# EAGLE design lm317-laser-driver-mk-1.0 (EAGLE 7.5.0)
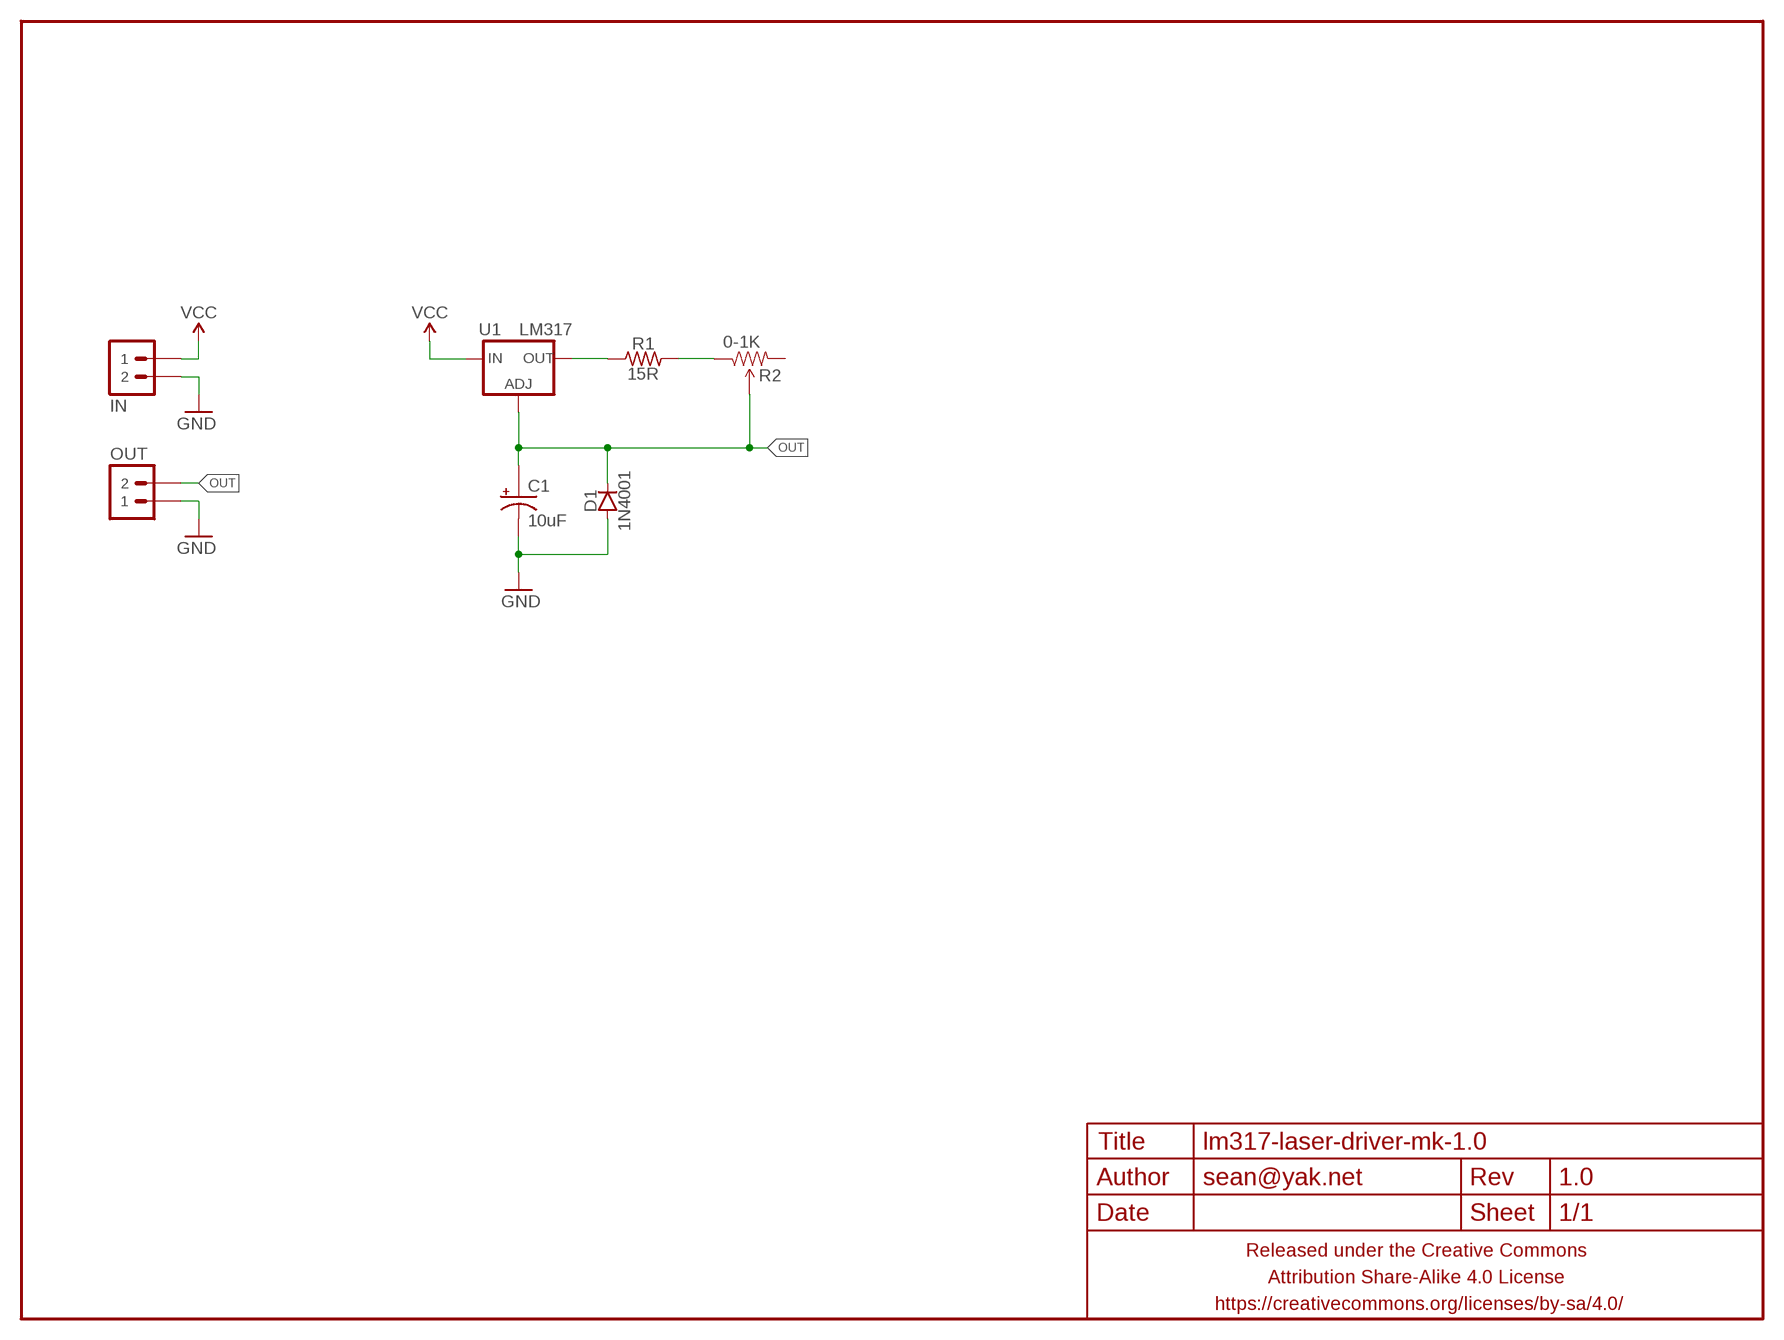
[diagram p0: schematic, sheet 1]

## Parts
C1  10uF  CAPACITOR-POLARIZEDE2.5-6  [E2,5-6]
D1  1N4001  DIODEPTH-10.68MM-NOSYM  [DIODE-10.16MM-NOSYMBOL]
FRAME1  FRAME-LETTERNO_PACKAGE  [DUMMY]
IN  M02PTH-CENTERED-R+  [1X02-CENTER-R+]
OUT  M02PTH-CENTERED-R+  [1X02-CENTER-R+]
R1  15R  RESISTORPTH-AXIAL-10.16MM  [RESISTOR-AXIAL-PTH-10.16MM]
R2  0-1K  TRIMPOTPTH2  [TRIM_POT_PTH2]
U1  LM317  V_REG_317THERMPAD  [TO220-THERMPAD]

## Nets
GND: C1.- D1.A IN.2 OUT.1
N$1: R1.P$2 R2.1(CCW)
N$2: R1.P$1 U1.2@1(OUT) U1.2@2(OUT)
OUT: C1.+ D1.C OUT.2 R2.2(WIPER) U1.1(ADJ)
VCC: IN.1 U1.3(IN)
Unconnected: R2.3(CW)

## Library data of the parts
C1 = a_parts:CAPACITOR-POLARIZED: POLARIZED CAPACITOR, American symbol
D1 = a_parts:DIODE: Diode These are standard reverse protection diodes and small signal diodes. SMA package can handle up to about 1A. SOD-323 can handle about 200mA. What the SOD-323 package when ordering, there are some mfgs out there that are 5-pin packages.
FRAME1 = a_parts:FRAME-LETTER: Schematic Frame Standard 8.5x11 US Letter frame; DESIGNER: sean@yak.net; VERSION: 1.0
IN OUT = a_parts:M02: Standard 2-pin 0.1" header. Use with - straight break away headers ( PRT-00116) - right angle break away headers (PRT-00553) - swiss pins (PRT-00743) - machine pins (PRT-00117) - female headers (PRT-00115) Molex polarized connector foot print use with: PRT-08233 with associated crimp pins and housings. 2.54_SCREWTERM for use with PRT-10571. 3.5mm Screw Terminal footprints for PRT-08084 5mm Screw Terminal footprints for use with PRT-08433
R1 = a_parts:RESISTOR: RESISTOR, American symbol
R2 = a_parts:TRIMPOT: Various small potentiometers for "set-and-forget" applications
U1 = a_parts:V_REG_317: Voltage Regulator Standard LM317 adjustable voltage regulator. AOI (Adjust Output Input). Google 'LM317 Calculator' for easy to use app to get the two resistor values needed. 240/720 for 5V output. 240/390 for 3.3V output. Spark Fun Electronics SKU : COM-00527

## Board
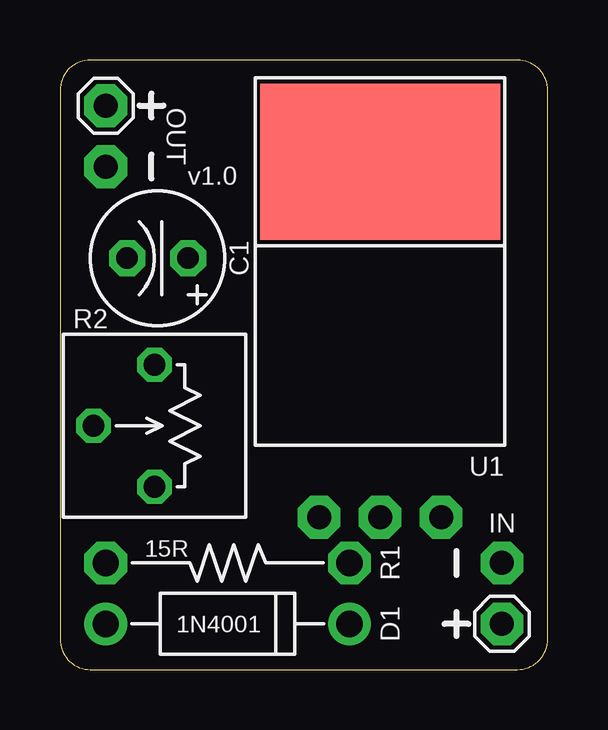
[diagram p1: board, top side]
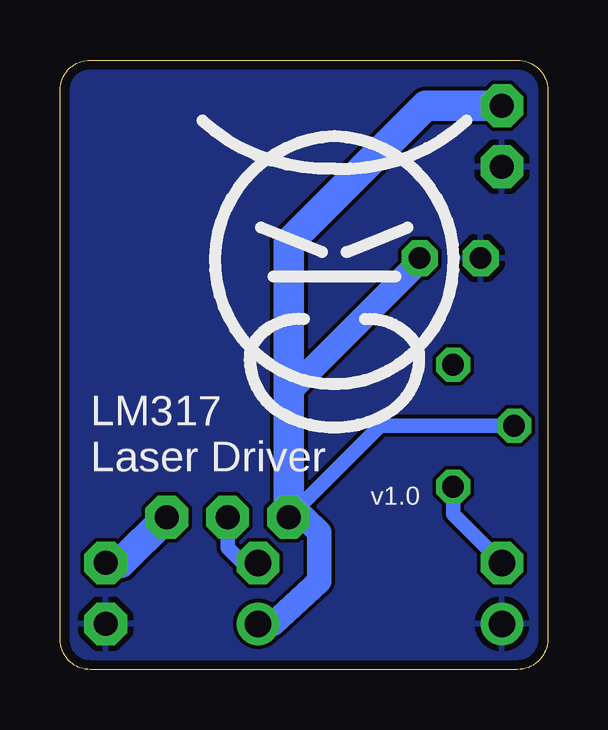
[diagram p2: board, bottom side, seen from below]

Size 20.32 x 25.4 mm. Coordinates in mm from the lower left corner, seen from the top.
Outline: 0,24.13 0,1.27 arc90 1.27,0 19.05,0 arc90 20.32,1.27 20.32,24.13 arc90 19.05,25.4 1.27,25.4 arc90 0,24.13
Copper layers (1*16): Top 0.0356mm / dielectric 1.5011mm / Bottom 0.0356mm
Design rules "LaenPCBOrder_2": minimum track width 6mil, minimum drill 13mil, track to track 6mil, track to pad 6mil, pad to pad 6mil, via to via 6mil, smd to smd 6mil, copper to edge 15mil, drill to drill 6mil, minimum pad ring 7mil, minimum via ring 7mil, stop-mask expansion 3mil, vias tented up to drill 20mil, thermal gap 10mil

### Footprints (pad centres in the part's own frame; a part is rotated, then mirrored left to right if it is on the bottom)
E2,5-6 = drill 0.9 pad 1.5 octagon: + -1.27,0; - 1.27,0
DIODE-10.16MM-NOSYMBOL = drill 1.1 pad 1.778: A -5.08,0; C 5.08,0
1X02-CENTER-R+ = drill 1 pad 1.778 octagon: 1 -1.27,0; 2 1.27,0
RESISTOR-AXIAL-PTH-10.16MM = drill 1.1 pad 1.778 octagon: P$1 -5.08,0; P$2 5.08,0
TRIM_POT_PTH2 = drill 0.9 pad 1.422 octagon: 1 -2.54,0; 2 0,2.54; 3 2.54,0
TO220-THERMPAD = drill 1 pad 1.778 octagon: 1 -2.54,0; 2@2 0,0; 3 2.54,0 | smd 10 x 6.5: 2@1 0,14.81

### Placement (x,y rotation side)
C1  4.06,17.14 180 top
D1  6.99,1.91 0 top
FRAME1  0,0 0 top
IN  18.41,3.17 270 top
OUT  1.91,22.23 90 top
R1  6.99,4.45 180 top
R2  3.94,10.16 90 top
U1  13.34,6.35 0 top
U$1  [COW]  8.89,15.88 0 bottom

### Tracks (layer width: path | path; a pad name or v marks a point on that pad's centre or on a via)
GND
  pour Bottom: 0,24.13 0,1.27 arc90 1.27,0 19.05,0 arc90 20.32,1.27 20.32,24.13 arc90 19.05,25.4 1.27,25.4 arc90
N$1
  Bottom 0.61: R1.P$2 3.94,6.48 R2.1
N$2
  Bottom 0.61: R1.P$1 12.7,4.45 13.34,5.08 U1.2@2
OUT
  Bottom 0.61: R2.2 6.99,10.16 U1.1
  Bottom 1.016: C1.+ 5.33,17.02 10.79,11.56 | U1.1 10.16,6.35 9.53,5.71 9.53,3.68 11.43,1.91 D1.C
  Bottom 1.27: OUT.2 5.08,23.5 10.79,17.78 10.79,11.56 U1.1
VCC
  Bottom 1.27: IN.1 17.78,4.45 U1.3

### Text on the board
bPlace: LM317 / Laser Driver